# EAGLE design bbf-thonkjacks (EAGLE 7.2.0)
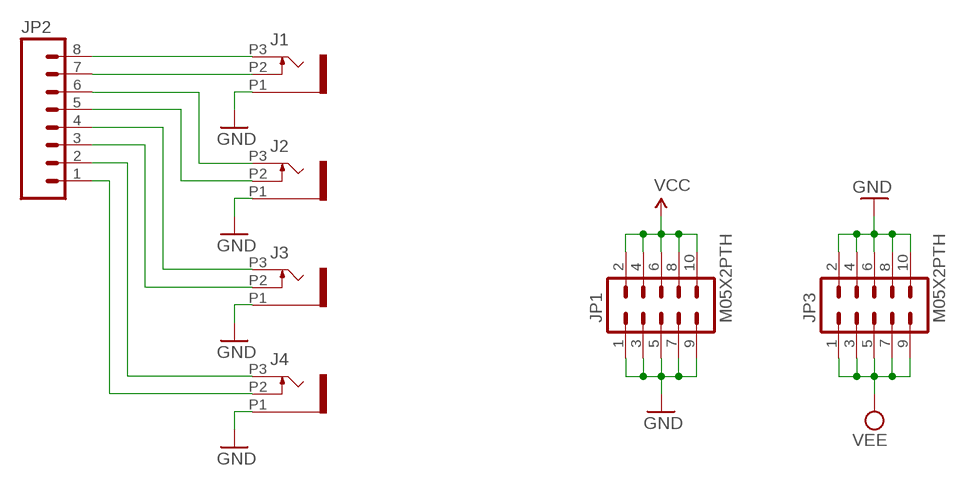
[diagram p0: schematic, sheet 1]

## Parts
J1  OG-PJ301_PJ301_THONKICONN4  [OG-PJ301_WQP_PJ_301M4]
J2  OG-PJ301_PJ301_THONKICONN4  [OG-PJ301_WQP_PJ_301M4]
J3  OG-PJ301_PJ301_THONKICONN4  [OG-PJ301_WQP_PJ_301M4]
J4  OG-PJ301_PJ301_THONKICONN4  [OG-PJ301_WQP_PJ_301M4]
JP1  M05X2PTH  [AVR_ICSP]
JP2  M08  [1X08]
JP3  M05X2PTH  [AVR_ICSP]

## Nets
GND: J1.P1 J2.P1 J3.P1 J4.P1 JP1.1 JP1.3 JP1.5 JP1.7 JP1.9 JP3.2 JP3.4 JP3.6 JP3.8 JP3.10
N$1: J2.P3 JP2.6
N$2: J2.P2 JP2.5
N$3: J3.P3 JP2.4
N$4: J3.P2 JP2.3
N$5: J4.P3 JP2.2
N$6: J4.P2 JP2.1
N$7: J1.P3 JP2.8
N$8: J1.P2 JP2.7
VCC: JP1.2 JP1.4 JP1.6 JP1.8 JP1.10
VEE: JP3.1 JP3.3 JP3.5 JP3.7 JP3.9

## Library data of the parts
J1-J4 = tomatek:OG-PJ301_PJ301_THONKICONN
JP1 JP3 = SparkFun:M05X2: Header 5x2 Standard 10-pin dual row 0.1" header. Commonly used with AVR-ISP. Use with Spark Fun Electronics SKU: PRT-00778
JP2 = SparkFun:M08: Header 8 Standard 8-pin 0.1" header. Use with straight break away headers (SKU : PRT-00116), right angle break away headers (PRT-00553), swiss pins (PRT-00743), machine pins (PRT-00117), and female headers (PRT-00115).

## Board
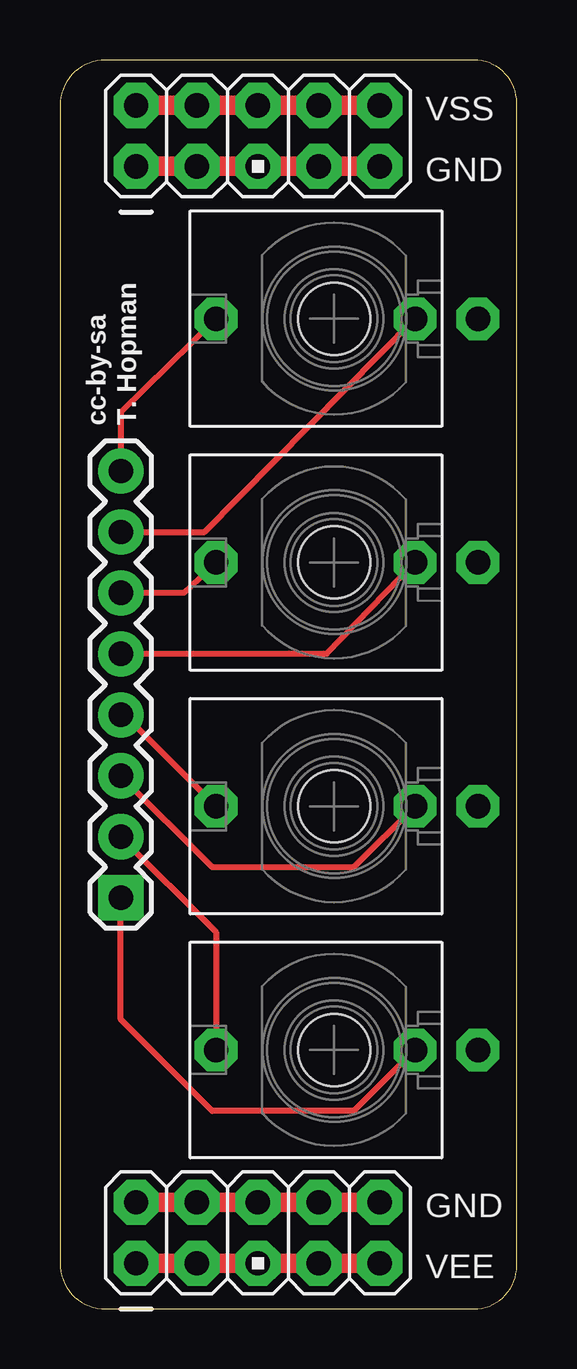
[diagram p1: board, top side]
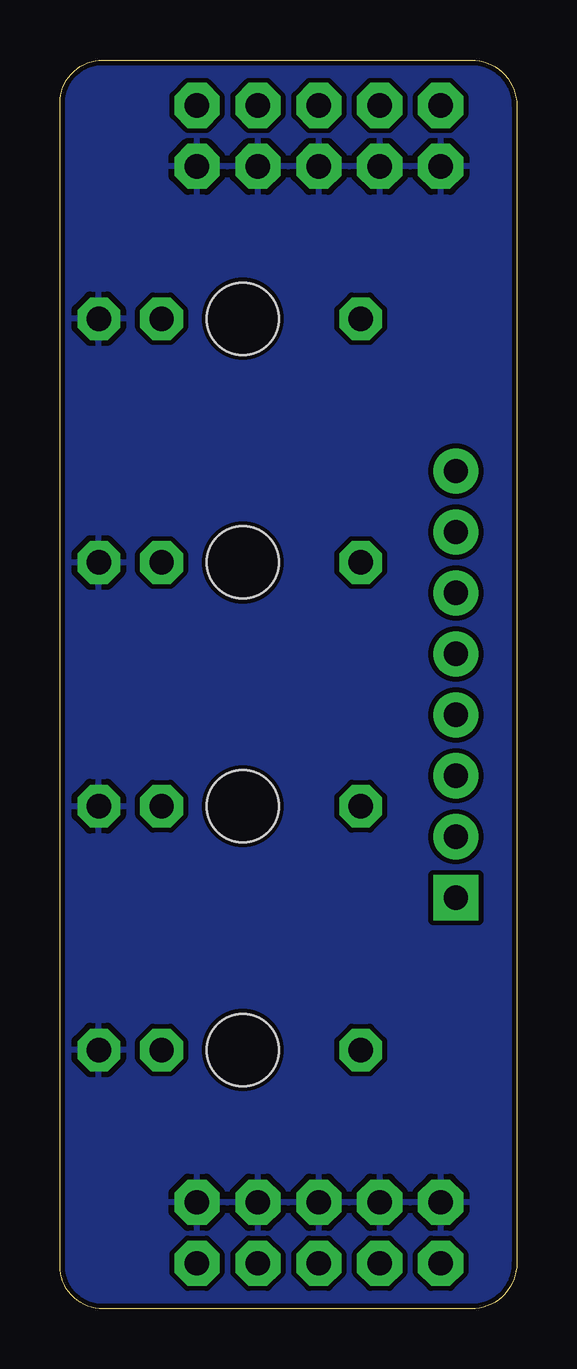
[diagram p2: board, bottom side, seen from below]

Size 19.05 x 52.06 mm. Coordinates in mm from the lower left corner, seen from the top.
Outline: 1.91,0 17.25,0 arc90 19.05,1.8 19.05,50.27 arc90 17.26,52.06 1.9,52.06 arc90 0,50.16 0,1.91 arc90 1.91,0
Copper layers (1*16): Top 0.035mm / dielectric 1.5mm / Bottom 0.035mm
Design rules "SparkFun_10mil *": minimum track width 8mil, minimum drill 20mil, track to track 8mil, track to pad 8mil, pad to pad 8mil, via to via 8mil, smd to smd 8mil, copper to edge 8mil, drill to drill 8mil, minimum pad ring 12mil, minimum via ring 10mil, stop-mask expansion 4mil, vias tented up to drill 25mil, thermal gap 10mil

### Footprints (pad centres in the part's own frame; a part is rotated, then mirrored left to right if it is on the bottom)
OG-PJ301_WQP_PJ_301M4 = drill 1.016 pad 1.778 octagon: P1 0,-6; P2 0,-3.38; P3 0,4.92 | hole 3: 0,0
AVR_ICSP = drill 1.016 pad 1.88 octagon: 1 -1.27,5.08; 2 1.27,5.08; 3 -1.27,2.54; 4 1.27,2.54; 5 -1.27,0; 6 1.27,0; 7 -1.27,-2.54; 8 1.27,-2.54; 9 -1.27,-5.08; 10 1.27,-5.08
1X08 = drill 1.016 pad 1.88 square: 1 0,0 | drill 1.016 pad 1.88: 2 2.54,0; 3 5.08,0; 4 7.62,0; 5 10.16,0; 6 12.7,0; 7 15.24,0; 8 17.78,0

### Placement (x,y rotation side)
J1  11.43,41.27 90 top
J2  11.43,31.11 90 top
J3  11.43,20.95 90 top
J4  11.43,10.79 90 top
JP1  8.26,48.9 90 top
JP2  2.54,17.14 90 top
JP3  8.26,3.17 90 top

### Tracks (layer width: path | path; a pad name or v marks a point on that pad's centre or on a via)
GND
  Top 0.813: JP1.1 JP1.9 | JP3.2 JP3.10
  pour Bottom: 1.91,0 19.05,0 19.05,52.07 1.91,52.07 arc90 0,50.16 0,1.91 arc90
N$1
  Top 0.254: J2.P3 5.16,29.84 JP2.6
N$2
  Top 0.254: J2.P2 11.12,27.3 JP2.5
N$3
  Top 0.254: JP2.4 2.7,24.77 J3.P3
N$4
  Top 0.254: JP2.3 6.35,18.41 12.27,18.41 J3.P2
N$5
  Top 0.254: JP2.2 6.51,15.71 J4.P3
N$6
  Top 0.254: J4.P2 12.27,8.26 6.35,8.26 2.54,12.06 JP2.1
N$7
  Top 0.254: J1.P3 2.54,37.38 JP2.8
N$8
  Top 0.254: JP2.7 6.04,32.38 J1.P2
VCC
  Top 0.813: JP1.2 JP1.4 JP1.6 JP1.8 JP1.10
VEE
  Top 0.813: JP3.1 JP3.3 JP3.5 JP3.7 JP3.9

### Text on the board
tPlace: VSS | GND | GND | VEE
tNames: cc-by-sa | T. Hopman